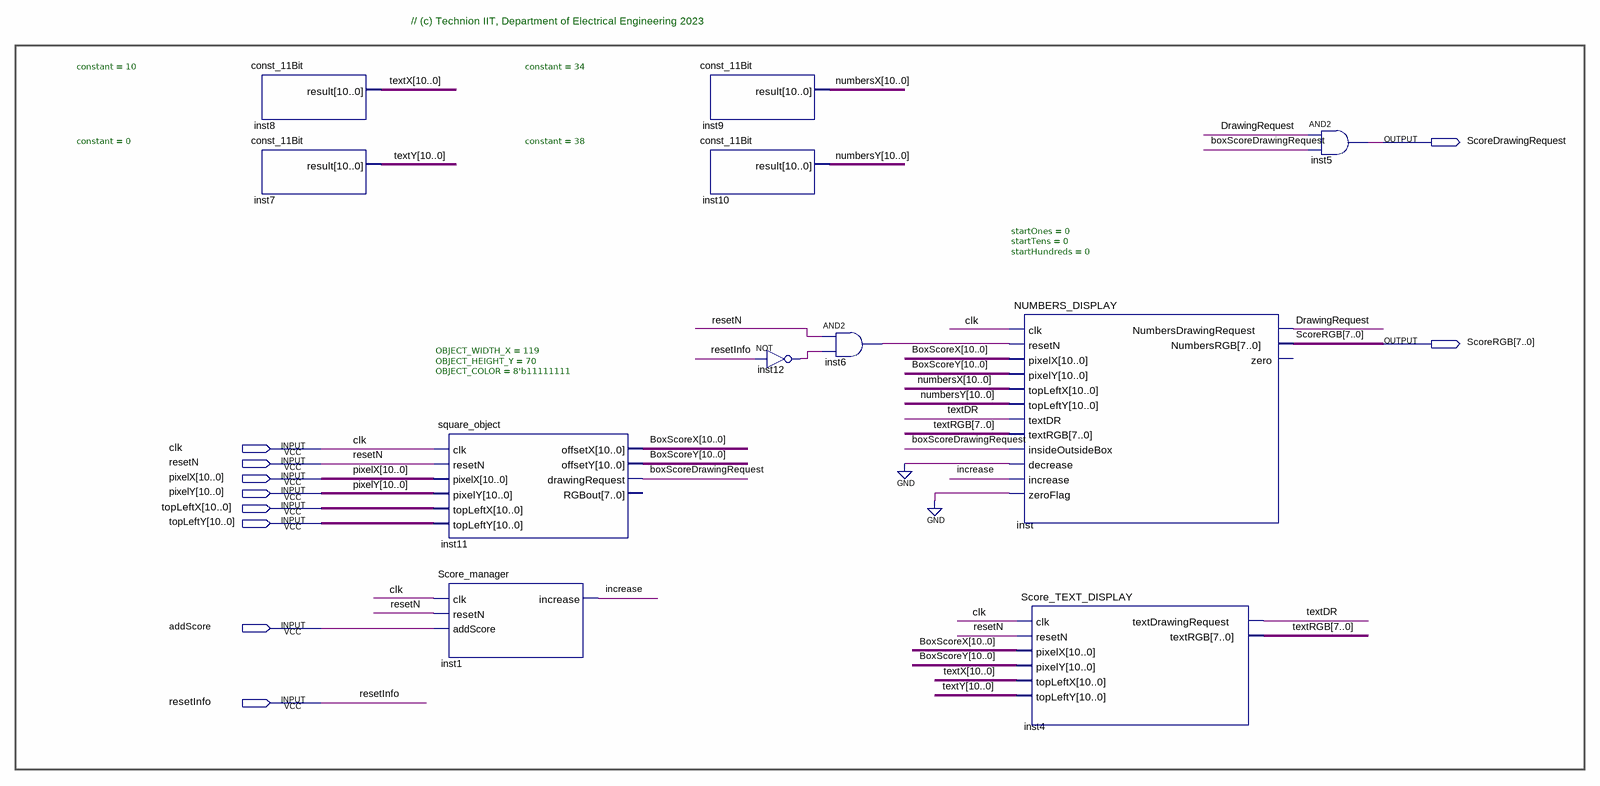
[diagram p0: schematic sheet]
// Quartus schematic SCORE_DISPLAY.bdf as structural Verilog: 11 symbols, 10 pins
module SCORE_DISPLAY (
  input  clk,
  input  resetN,
  input  [10:0] pixelX,
  input  [10:0] pixelY,
  input  [10:0] topLeftX,
  input  [10:0] topLeftY,
  input  addScore,
  input  resetInfo,
  output ScoreDrawingRequest,
  output [7:0] ScoreRGB
);

  wire boxScoreDrawingRequest, DrawingRequest, increase, inst6_out, inst12_out, textDR;
  wire [7:0] textRGB;
  wire [10:0] BoxScoreX, BoxScoreY, numbersX, numbersY, textX, textY;

  const_11Bit #(.constant(10)) inst8 (.result(textX));
  const_11Bit #(.constant(0)) inst7 (.result(textY));
  square_object #(.OBJECT_WIDTH_X(119), .OBJECT_HEIGHT_Y(70), .OBJECT_COLOR(8'b11111111)) inst11 (
    .clk(clk), .resetN(resetN), .pixelX(pixelX), .pixelY(pixelY), .topLeftX(topLeftX), .topLeftY(topLeftY),
    .offsetX(BoxScoreX), .offsetY(BoxScoreY), .drawingRequest(boxScoreDrawingRequest));  // open: RGBout
  Score_manager inst1 (.clk(clk), .resetN(resetN), .addScore(addScore), .increase(increase));
  const_11Bit #(.constant(34)) inst9 (.result(numbersX));
  const_11Bit #(.constant(38)) inst10 (.result(numbersY));
  not inst12 (inst12_out, resetInfo);
  and inst6 (inst6_out, resetN, inst12_out);
  NUMBERS_DISPLAY #(.startOnes(0), .startTens(0), .startHundreds(0)) inst (
    .clk(clk), .resetN(inst6_out), .pixelX(BoxScoreX), .pixelY(BoxScoreY), .topLeftX(numbersX),
    .topLeftY(numbersY), .textDR(textDR), .textRGB(textRGB), .insideOutsideBox(boxScoreDrawingRequest),
    .decrease(1'b0), .increase(increase), .zeroFlag(1'b0), .NumbersDrawingRequest(DrawingRequest),
    .NumbersRGB(ScoreRGB));  // open: zero
  Score_TEXT_DISPLAY inst4 (
    .clk(clk), .resetN(resetN), .pixelX(BoxScoreX), .pixelY(BoxScoreY), .topLeftX(textX), .topLeftY(textY),
    .textDrawingRequest(textDR), .textRGB(textRGB));
  and inst5 (ScoreDrawingRequest, DrawingRequest, boxScoreDrawingRequest);

  // Notes on the sheet:
  //   // (c) Technion IIT, Department of Electrical Engineering 2023
endmodule
